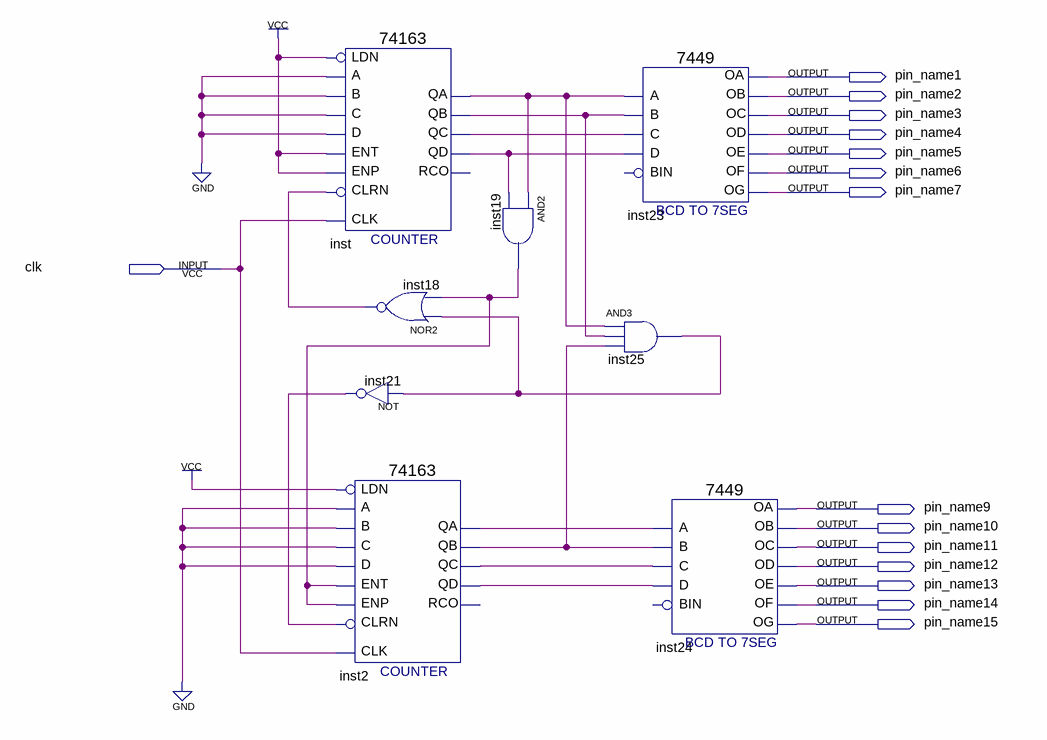
[diagram p0: schematic sheet]
// Quartus schematic five.bdf as structural Verilog: 8 symbols, 15 pins
module five (
  input  clk,
  output pin_name1,
  output pin_name2,
  output pin_name3,
  output pin_name4,
  output pin_name5,
  output pin_name6,
  output pin_name7,
  output pin_name9,
  output pin_name10,
  output pin_name11,
  output pin_name12,
  output pin_name13,
  output pin_name14,
  output pin_name15
);

  wire inst2_qa, inst2_qb, inst2_qc, inst2_qd, inst18_out, inst19_out, inst21_out, inst25_out, inst_qa,
       inst_qb, inst_qc, inst_qd;

  \74163  inst (
    .C(1'b0), .B(1'b0), .A(1'b0), .ENT(1'b1), .D(1'b0), .CLRN(inst18_out), .CLK(clk), .ENP(1'b1), .LDN(1'b1),
    .QA(inst_qa), .QB(inst_qb), .QC(inst_qc), .QD(inst_qd));  // open: RCO
  nor inst18 (inst18_out, inst25_out, inst19_out);
  not inst21 (inst21_out, inst25_out);
  \74163  inst2 (
    .C(1'b0), .B(1'b0), .A(1'b0), .ENT(inst19_out), .D(1'b0), .CLRN(inst21_out), .CLK(clk), .ENP(inst19_out),
    .LDN(1'b1), .QA(inst2_qa), .QB(inst2_qb), .QC(inst2_qc), .QD(inst2_qd));  // open: RCO
  and inst19 (inst19_out, inst_qa, inst_qd);
  \7449  inst23 (
    .A(inst_qa), .C(inst_qc), .B(inst_qb), .D(inst_qd), .OC(pin_name3), .OD(pin_name4), .OF(pin_name6),
    .OG(pin_name7), .OB(pin_name2), .OA(pin_name1), .OE(pin_name5));  // open: BIN
  and inst25 (inst25_out, inst_qa, inst_qb, inst2_qb);
  \7449  inst24 (
    .A(inst2_qa), .C(inst2_qc), .B(inst2_qb), .D(inst2_qd), .OC(pin_name11), .OD(pin_name12),
    .OF(pin_name14), .OG(pin_name15), .OB(pin_name10), .OA(pin_name9), .OE(pin_name13));  // open: BIN
endmodule
